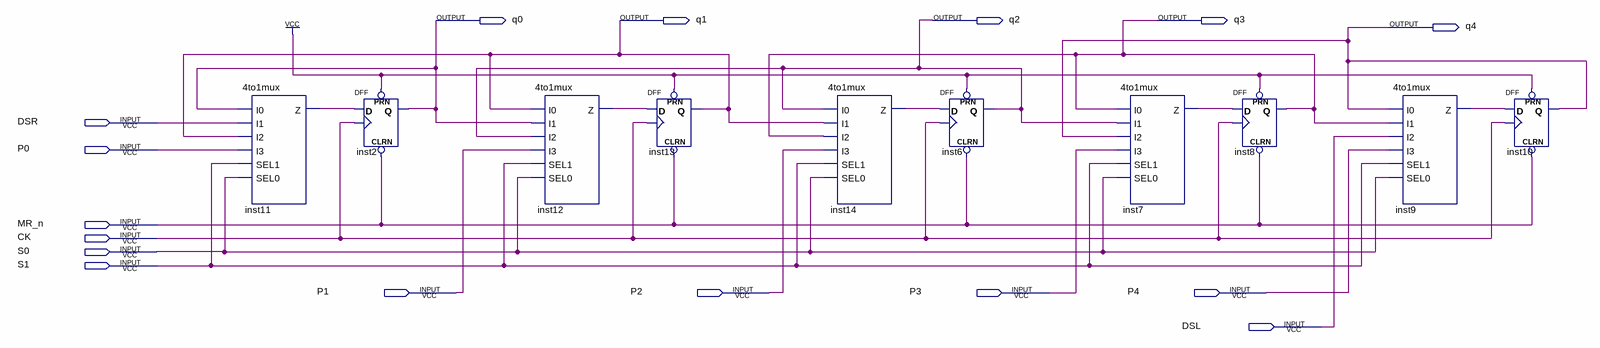
[diagram p0: schematic sheet]
// Quartus schematic shift_reg.bdf as structural Verilog: 10 symbols, 16 pins
module shift_reg (
  input  DSR,
  input  P0,
  input  MR_n,
  input  CK,
  input  S0,
  input  S1,
  input  P1,
  input  P2,
  input  P3,
  input  P4,
  input  DSL,
  output q0,
  output q1,
  output q2,
  output q3,
  output q4
);

  wire inst7_z, inst9_z, inst11_z, inst12_z, inst14_z;

  \4to1mux  inst11 (.I0(q0), .I1(DSR), .I2(q1), .I3(P0), .SEL1(S1), .SEL0(S0), .Z(inst11_z));
  DFF inst2 (.CLRN(MR_n), .CLK(CK), .D(inst11_z), .PRN(1'b1), .Q(q0));
  \4to1mux  inst12 (.I0(q1), .I1(q0), .I2(q2), .I3(P1), .SEL1(S1), .SEL0(S0), .Z(inst12_z));
  DFF inst13 (.CLRN(MR_n), .CLK(CK), .D(inst12_z), .PRN(1'b1), .Q(q1));
  \4to1mux  inst14 (.I0(q2), .I1(q1), .I2(q3), .I3(P2), .SEL1(S1), .SEL0(S0), .Z(inst14_z));
  DFF inst6 (.CLRN(MR_n), .CLK(CK), .D(inst14_z), .PRN(1'b1), .Q(q2));
  \4to1mux  inst7 (.I0(q3), .I1(q2), .I2(q4), .I3(P3), .SEL1(S1), .SEL0(S0), .Z(inst7_z));
  DFF inst8 (.CLRN(MR_n), .CLK(CK), .D(inst7_z), .PRN(1'b1), .Q(q3));
  \4to1mux  inst9 (.I0(q4), .I1(q3), .I2(DSL), .I3(P4), .SEL1(S1), .SEL0(S0), .Z(inst9_z));
  DFF inst10 (.CLRN(MR_n), .CLK(CK), .D(inst9_z), .PRN(1'b1), .Q(q4));
endmodule
